# Altium schematic sheet SD_card.SchDoc
size 209 x 297 mm; CmpIndex: 71; SymIndex: 29
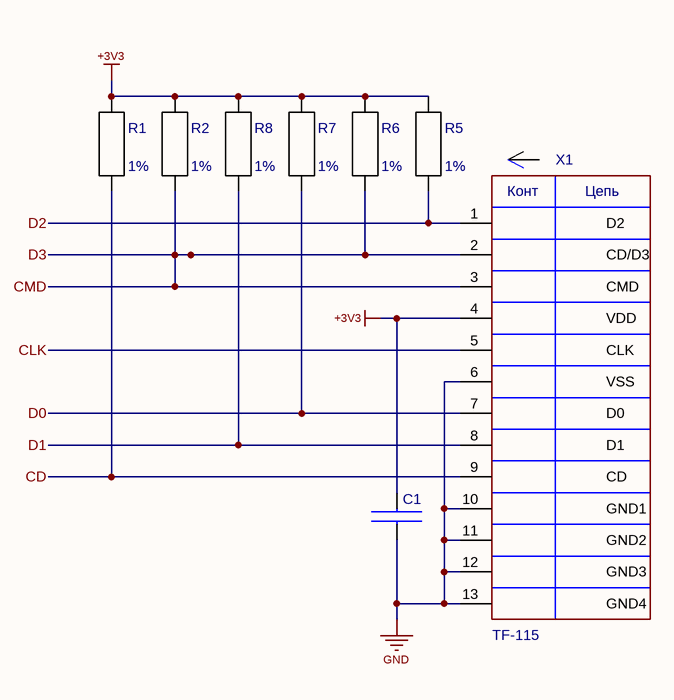
[diagram p0: SD_card.SchDoc]

## Parts
C1  0402-0.1uF-50V-10%-X7R  (value not drawn)
R1  Tolerance: 1%  (hidden comment: 0402-10k-1%-1/16 W-100ppm)
R2  Tolerance: 1%  (hidden comment: 0402-10k-1%-1/16 W-100ppm)
R5  Tolerance: 1%  (hidden comment: 0402-100k-1%-1/16 W-100ppm)
R6  Tolerance: 1%  (hidden comment: 0402-100k-1%-1/16 W-100ppm)
R7  Tolerance: 1%  (hidden comment: 0402-100k-1%-1/16 W-100ppm)
R8  Tolerance: 1%  (hidden comment: 0402-100k-1%-1/16 W-100ppm)
X1  TF-115

## Nets
+3V3: C1.2 R1.2 R2.2 R5.2 R6.2 R7.2 R8.2 X1.4(VDD)
GND: C1.1 X1.6(VSS) X1.10(GND1) X1.11(GND2) X1.12(GND3) X1.13(GND4)
CD: R1.1 X1.9(CD)
CLK: X1.5(CLK)
CMD: R2.1 R6.1 X1.2(CD/D3) X1.3(CMD)  [also labelled D3]
D0: R7.1 X1.7(D0)
D1: R8.1 X1.8(D1)
D2: R5.1 X1.1(D2)

## Notes on the sheet
- Лист
- Изм.
- № Докум.
- Подп.
- Дата
- (in symbol TF-115) Конт; Цепь

## Library data of the parts
C1 = 0402-0.1uF-50V-10%-X7R: Cell Name: 0402_CAPC100X50X55L25N; CmpIndex: 9; DXDB_LIBNAME: Capacitors Ceramic SMD; Ref Designator: C1; SymIndex: 25; Tolerance: 10%; Orientation: 1 = 1; Part Label: 0402-0.1uF-50V-10%-X7R; Part Name: 0402-0.1uF-50V-10%-X7R; Part Number NP: 0402-0.1uF-50V-10%-X7R; Part Number: 0402-0.1uF-50V-10%-X7R
R1 = 0402-10k-1%-1/16 W-100ppm: Cell Name: 0402_RESC100X50X35L25N; CmpIndex: 10; DXDB_LIBNAME: Resistors Surface Mount; Ref Designator: R1; SymIndex: 13; Orientation: 1 = 1; Part Label: 0402-10k-1%-1/16 W-100ppm; Part Name: 0402-10k-1%-1/16 W-100ppm; Part Number NP: 0402-10k-1%-1/16 W-100ppm; Part Number: 0402-10k-1%-1/16 W-100ppm
R2 = 0402-10k-1%-1/16 W-100ppm: Cell Name: 0402_RESC100X50X35L25N; CmpIndex: 11; DXDB_LIBNAME: Resistors Surface Mount; Ref Designator: R2; SymIndex: 13; Orientation: 1 = 1; Part Label: 0402-10k-1%-1/16 W-100ppm; Part Name: 0402-10k-1%-1/16 W-100ppm; Part Number NP: 0402-10k-1%-1/16 W-100ppm; Part Number: 0402-10k-1%-1/16 W-100ppm
R5 = 0402-100k-1%-1/16 W-100ppm: Cell Name: 0402_RESC100X50X35L25N; CmpIndex: 12; DXDB_LIBNAME: Resistors Surface Mount; Ref Designator: R5; SymIndex: 13; Orientation: 1 = 1; Part Label: 0402-100k-1%-1/16 W-100ppm; Part Name: 0402-100k-1%-1/16 W-100ppm; Part Number NP: 0402-100k-1%-1/16 W-100ppm; Part Number: 0402-100k-1%-1/16 W-100ppm
R6 = 0402-100k-1%-1/16 W-100ppm: Cell Name: 0402_RESC100X50X35L25N; CmpIndex: 13; DXDB_LIBNAME: Resistors Surface Mount; Ref Designator: R6; Orientation: 1 = 1; Part Label: 0402-100k-1%-1/16 W-100ppm; Part Name: 0402-100k-1%-1/16 W-100ppm; Part Number NP: 0402-100k-1%-1/16 W-100ppm; Part Number: 0402-100k-1%-1/16 W-100ppm; SymIndex: 13
R7 = 0402-100k-1%-1/16 W-100ppm: Cell Name: 0402_RESC100X50X35L25N; CmpIndex: 14; DXDB_LIBNAME: Resistors Surface Mount; Ref Designator: R7; SymIndex: 13; Orientation: 1 = 1; Part Label: 0402-100k-1%-1/16 W-100ppm; Part Name: 0402-100k-1%-1/16 W-100ppm; Part Number NP: 0402-100k-1%-1/16 W-100ppm; Part Number: 0402-100k-1%-1/16 W-100ppm
R8 = 0402-100k-1%-1/16 W-100ppm: Cell Name: 0402_RESC100X50X35L25N; CmpIndex: 15; DXDB_LIBNAME: Resistors Surface Mount; Ref Designator: R8; SymIndex: 13; Orientation: 1 = 1; Part Label: 0402-100k-1%-1/16 W-100ppm; Part Name: 0402-100k-1%-1/16 W-100ppm; Part Number NP: 0402-100k-1%-1/16 W-100ppm; Part Number: 0402-100k-1%-1/16 W-100ppm
X1 = TF-115: Cell Name: TF-115 SD card; CmpIndex: 0; Ref Designator: X1; Orientation: 0 = 0; Part Label: TF-115; Part Name: TF-115; Part Number: TF-115; SymIndex: 0